# Altium schematic sheet [3]-MCU_MAIN.SchDoc
size A4
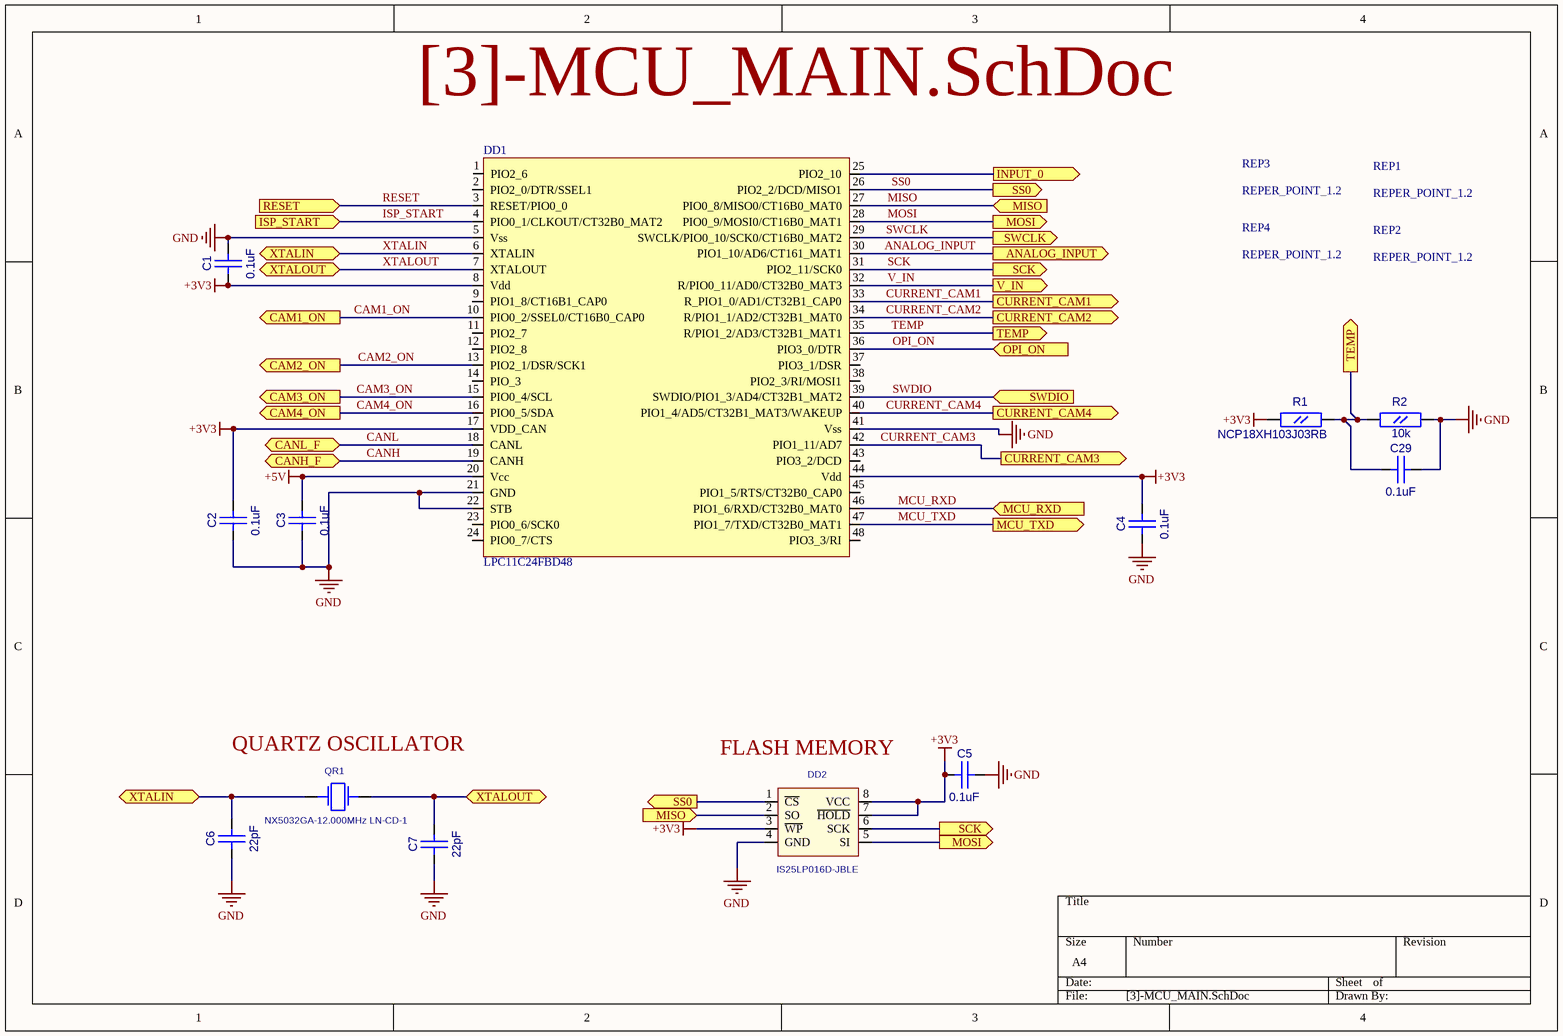
[diagram p0: [3]-MCU_MAIN.SchDoc]

## Parts
C1  0.1uF  [CC0603]
C2  0.1uF  [CC0603]
C3  0.1uF  [CC0603]
C4  0.1uF  [CC0603]
C5  0.1uF  [CC0603]
C6  22pF  [CC0603]
C7  22pF  [CC0603]
C29  0.1uF  [CC0603]
DD1  LPC11C24FBD48  [LQFP48]
DD2  IS25LP016D-JBLE  [EIAJ_SO8]
QR1  NX5032GA-12.000MHz LN-CD-1  [AC5032_2]
R1  NCP18XH103J03RB  [RC0603]
R2  10k  [RC0603]
REP1  REPER_POINT_1.2  [REPER1.2]
REP2  REPER_POINT_1.2  [REPER1.2]
REP3  REPER_POINT_1.2  [REPER1.2]
REP4  REPER_POINT_1.2  [REPER1.2]

## Ports
ANALOG_INPUT (out), CAM1_ON (out), CAM2_ON (out), CAM3_ON (out), CAM4_ON (out), CANH_F (bidir), CANL_F (bidir), CURRENT_CAM1 (out), CURRENT_CAM2 (out), CURRENT_CAM3 (out), CURRENT_CAM4 (out), INPUT_0 (out), ISP_START (in), MCU_RXD (in), MCU_TXD (out), MISO (in), MOSI (out), OPI_ON (in), RESET (in), SCK (out), SS0 (out), SWCLK (out), SWDIO (in), TEMP (out), V_IN (out), XTALIN (bidir), XTALOUT (bidir)

## Nets
+3V3: C1.1(A) C2.2(B) C4.2(B) C5.1(A) DD1.8(Vdd) DD1.17(VDD_CAN) DD1.44(Vdd) DD2.3(~{WP}) DD2.7(~{HOLD}) DD2.8(VCC) R1.1(A)
+5V: C3.2(B) DD1.20(Vcc)
GND: C1.2(B) C2.1(A) C3.1(A) C4.1(A) C5.2(B) C6.1(A) C7.1(A) C29.2(B) DD1.5(Vss) DD1.21(GND) DD1.22(STB) DD1.41(Vss) DD2.4(GND) R2.2(B)
ANALOG_INPUT: DD1.30(PIO1_10/AD6/CT161_MAT1) ; port ANALOG_INPUT
CAM1_ON: DD1.10(PIO0_2/SSEL0/CT16B0_CAP0) ; port CAM1_ON
CAM2_ON: DD1.13(PIO2_1/DSR/SCK1) ; port CAM2_ON
CAM3_ON: DD1.15(PIO0_4/SCL) ; port CAM3_ON
CAM4_ON: DD1.16(PIO0_5/SDA) ; port CAM4_ON
CANH: DD1.19(CANH) ; port CANH_F
CANL: DD1.18(CANL) ; port CANL_F
CURRENT_CAM1: DD1.33(R_PIO1_0/AD1/CT32B1_CAP0) ; port CURRENT_CAM1
CURRENT_CAM2: DD1.34(R/PIO1_1/AD2/CT32B1_MAT0) ; port CURRENT_CAM2
CURRENT_CAM3: DD1.42(PIO1_11/AD7) ; port CURRENT_CAM3
CURRENT_CAM4: DD1.40(PIO1_4/AD5/CT32B1_MAT3/WAKEUP) ; port CURRENT_CAM4
INPUT_0: DD1.25(PIO2_10) ; port INPUT_0
ISP_START: DD1.4(PIO0_1/CLKOUT/CT32B0_MAT2) ; port ISP_START
MCU_RXD: DD1.46(PIO1_6/RXD/CT32B0_MAT0) ; port MCU_RXD
MCU_TXD: DD1.47(PIO1_7/TXD/CT32B0_MAT1) ; port MCU_TXD
MISO: DD1.27(PIO0_8/MISO0/CT16B0_MAT0) DD2.2(SO) ; port MISO
MOSI: DD1.28(PIO0_9/MOSI0/CT16B0_MAT1) DD2.5(SI) ; port MOSI
OPI_ON: DD1.36(PIO3_0/DTR) ; port OPI_ON
RESET: DD1.3(RESET/PIO0_0) ; port RESET
SCK: DD1.31(PIO2_11/SCK0) DD2.6(SCK) ; port SCK
SS0: DD1.26(PIO2_2/DCD/MISO1) DD2.1(~{CS}) ; port SS0
SWCLK: DD1.29(SWCLK/PIO0_10/SCK0/CT16B0_MAT2) ; port SWCLK
SWDIO: DD1.39(SWDIO/PIO1_3/AD4/CT32B1_MAT2) ; port SWDIO
TEMP: C29.1(A) DD1.35(R/PIO1_2/AD3/CT32B1_MAT1) R1.2(B) R2.1(A) ; port TEMP
V_IN: DD1.32(R/PIO0_11/AD0/CT32B0_MAT3) ; port V_IN
XTALIN: C6.2(B) DD1.6(XTALIN) QR1.1 ; port XTALIN
XTALOUT: C7.2(B) DD1.7(XTALOUT) QR1.2 ; port XTALOUT

Not connected (* = marked no-connect by the designer): DD1 1(PIO2_6) 2(PIO2_0/DTR/SSEL1) 9(PIO1_8/CT16B1_CAP0) 11(PIO2_7) 12(PIO2_8) 14(PIO_3) 23(PIO0_6/SCK0) 24(PIO0_7/CTS) 37(PIO3_1/DSR) 38(PIO2_3/RI/MOSI1) 43(PIO3_2/DCD) 45(PIO1_5/RTS/CT32B0_CAP0) 48(PIO3_3/RI); REP1 1; REP2 1; REP3 1; REP4 1

## Notes on the sheet
- (near QR1) QUARTZ OSCILLATOR
- (near DD2) FLASH MEMORY

## Library data of the parts
C1-C7 C29 = CC0603
  C1-C5 C29: Value: 0.1uF
  C6 C7: Value: 22pF
DD2 = S25FL016A0LMFI01: Value: IS25LP016D-JBLE
QR1 = AC5032_2: AC5032/2; Value: NX5032GA-12.000MHz LN-CD-1
R1 R2 = RC0603
  R1: Value: NCP18XH103J03RB
  R2: Value: 10k
REP1-REP4 = REPER1.2: Value: REPER_POINT_1.2
DD1 = LPC11C24FBD48: Value: LPC11C24FBD48